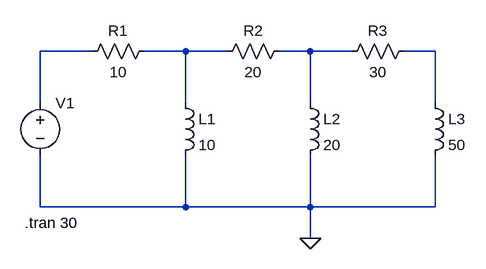
[diagram p0: schematic Draft6.asc]
Draft6.asc, the LTspice schematic file:
Version 4
SHEET 1 880 680
WIRE 0 16 -80 16
WIRE 144 16 80 16
WIRE 208 16 144 16
WIRE 336 16 288 16
WIRE 400 16 336 16
WIRE 528 16 480 16
WIRE -80 96 -80 16
WIRE 144 96 144 16
WIRE 336 96 336 16
WIRE 528 96 528 16
WIRE -80 256 -80 176
WIRE 144 256 144 176
WIRE 144 256 -80 256
WIRE 336 256 336 176
WIRE 336 256 144 256
WIRE 528 256 528 176
WIRE 528 256 336 256
WIRE 336 304 336 256
FLAG 336 304 0
SYMBOL res 96 0 R90
WINDOW 0 0 56 VBottom 2
WINDOW 3 32 56 VTop 2
SYMATTR InstName R1
SYMATTR Value 10
SYMBOL res 304 0 R90
WINDOW 0 0 56 VBottom 2
WINDOW 3 32 56 VTop 2
SYMATTR InstName R2
SYMATTR Value 20
SYMBOL res 496 0 R90
WINDOW 0 0 56 VBottom 2
WINDOW 3 32 56 VTop 2
SYMATTR InstName R3
SYMATTR Value 30
SYMBOL ind 128 80 R0
SYMATTR InstName L1
SYMATTR Value 10
SYMATTR SpiceLine Rser=1f
SYMBOL ind 320 80 R0
SYMATTR InstName L2
SYMATTR Value 20
SYMATTR SpiceLine Rser=1f
SYMBOL ind 512 80 R0
SYMATTR InstName L3
SYMATTR Value 50
SYMATTR SpiceLine Rser=0.001f
SYMBOL voltage -80 80 R0
WINDOW 3 24 96 Invisible 2
SYMATTR Value SINE(0 100 0.159154943092)
SYMATTR Value2 AC 37
SYMATTR InstName V1
TEXT -104 280 Left 2 !.tran 30

The netlist it stands for:
* Draft6.asc
R1 N002 N001 10
R2 N003 N002 20
R3 N004 N003 30
L1 N002 0 10 Rser=1f
L2 N003 0 20 Rser=1f
L3 N004 0 50 Rser=0.001f
V1 N001 0 SINE(0 100 0.159154943092) AC 37
.tran 30
.backanno
.end